# EAGLE design Power (EAGLE 8.5.2)
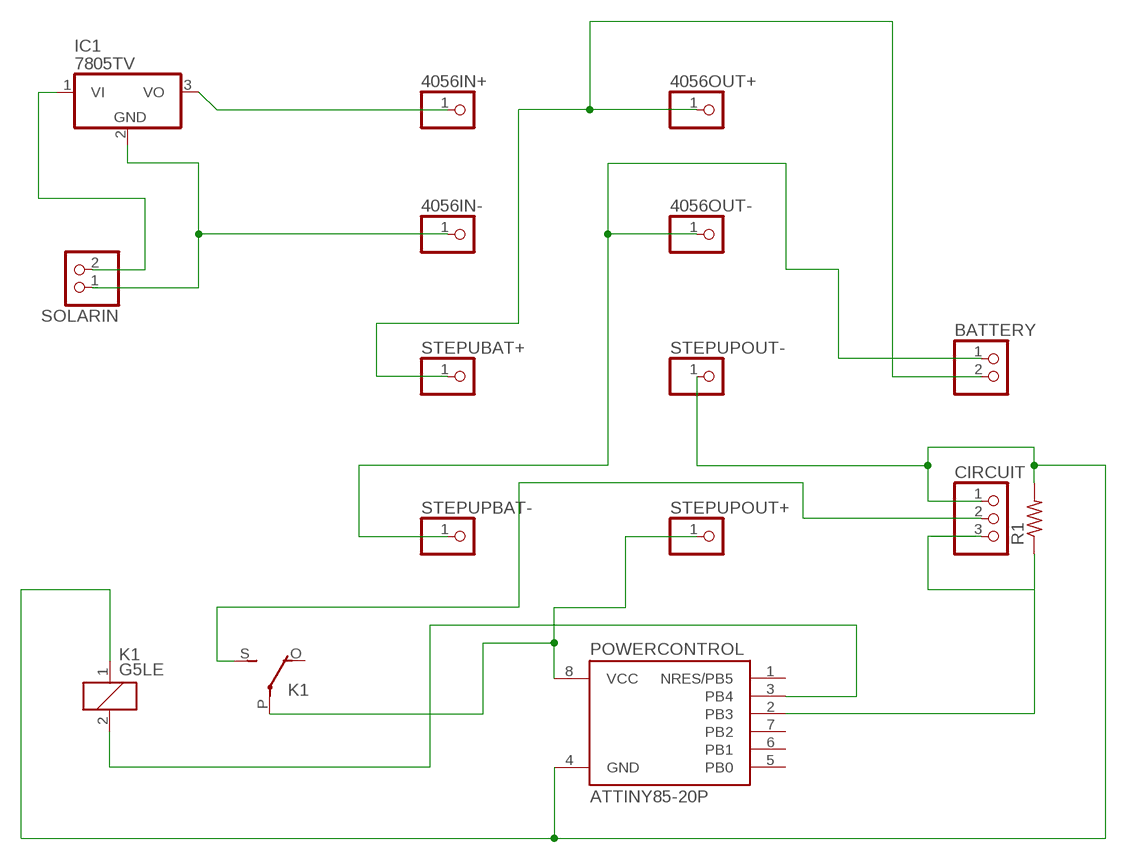
[diagram p0: schematic, sheet 1]

## Parts
4056IN+  PINHD-1X1  [1X01]
4056IN-  PINHD-1X1  [1X01]
4056OUT+  PINHD-1X1  [1X01]
4056OUT-  PINHD-1X1  [1X01]
BATTERY  PINHD-1X2  [1X02]
CIRCUIT  PINHD-1X3  [1X03]
IC1  7805TV  [TO220V]
K1  G5LE  [G5LE]
POWERCONTROL  ATTINY85-20P  [PDIP08_300MIL]
R1  R-US_0204/7  [0204/7]
SOLARIN  PINHD-1X2  [1X02]
STEPUBAT+  PINHD-1X1  [1X01]
STEPUPBAT-  PINHD-1X1  [1X01]
STEPUPOUT+  PINHD-1X1  [1X01]
STEPUPOUT-  PINHD-1X1  [1X01]

## Nets
N$1: IC1.1(VI) SOLARIN.2
N$2: 4056IN-.1 IC1.2(GND) SOLARIN.1
N$3: 4056IN+.1 IC1.3(VO)
N$4: 4056OUT+.1 BATTERY.2 STEPUBAT+.1
N$5: K1.2 POWERCONTROL.3(PB4)
N$6: K1.P(2:P) POWERCONTROL.8(VCC) STEPUPOUT+.1
N$7: CIRCUIT.2 K1.S(2:S)
N$8: CIRCUIT.1 K1.1 POWERCONTROL.4(GND) R1.2 STEPUPOUT-.1
N$11: CIRCUIT.3 POWERCONTROL.2(PB3) R1.1
N$12: 4056OUT-.1 BATTERY.1 STEPUPBAT-.1
Unconnected: K1.O(2:O) POWERCONTROL.1(NRES/PB5) POWERCONTROL.5(PB0) POWERCONTROL.6(PB1) POWERCONTROL.7(PB2)

## Library data of the parts
4056IN+ 4056IN- 4056OUT+ 4056OUT- STEPUBAT+ STEPUPBAT- STEPUPOUT+ STEPUPOUT- = pinhead:PINHD-1X1: PIN HEADER
BATTERY SOLARIN = pinhead:PINHD-1X2: PIN HEADER
CIRCUIT = pinhead:PINHD-1X3: PIN HEADER
IC1 = linear:78*: Positive VOLTAGE REGULATOR Source: http://cache.national.com/ds/LM/LM78L05.pdf http://www.fairchildsemi.com/ds/LM/LM7805.pdf
K1 = relay:G5LE: RELAY 1 x switch, 10 A/120 V AC, 8 A/30 V DC, Omron; OC_FARNELL: unknown; OC_NEWARK: unknown
POWERCONTROL = _hhn_attiny25_45_85:ATTINY85*: ATMEL ATtiny 85 Packages: P = PDIP 08 30mil S = SOIC 08 EIAJ 208mil Technologies Note: for complete ordering code (temp. range, finish, tape&reel etc.) see www.atmel.com • Supply Voltage: V = (1.8…5.5)V | [blank] = (2.7…5.5)V • Speed: 10 = 10 MHz | 20 = 20 MHz Author: Dipl.-Ing. FH Rainer Bayer HHN Hochschule Heilbronn (Heilbronn University), rainer.bayer@hs-heilbronn.de Ingenieurbüro ing-rb, mail@ing-rb.de
R1 = resistor:R-US_: RESISTOR, American symbol

## Board
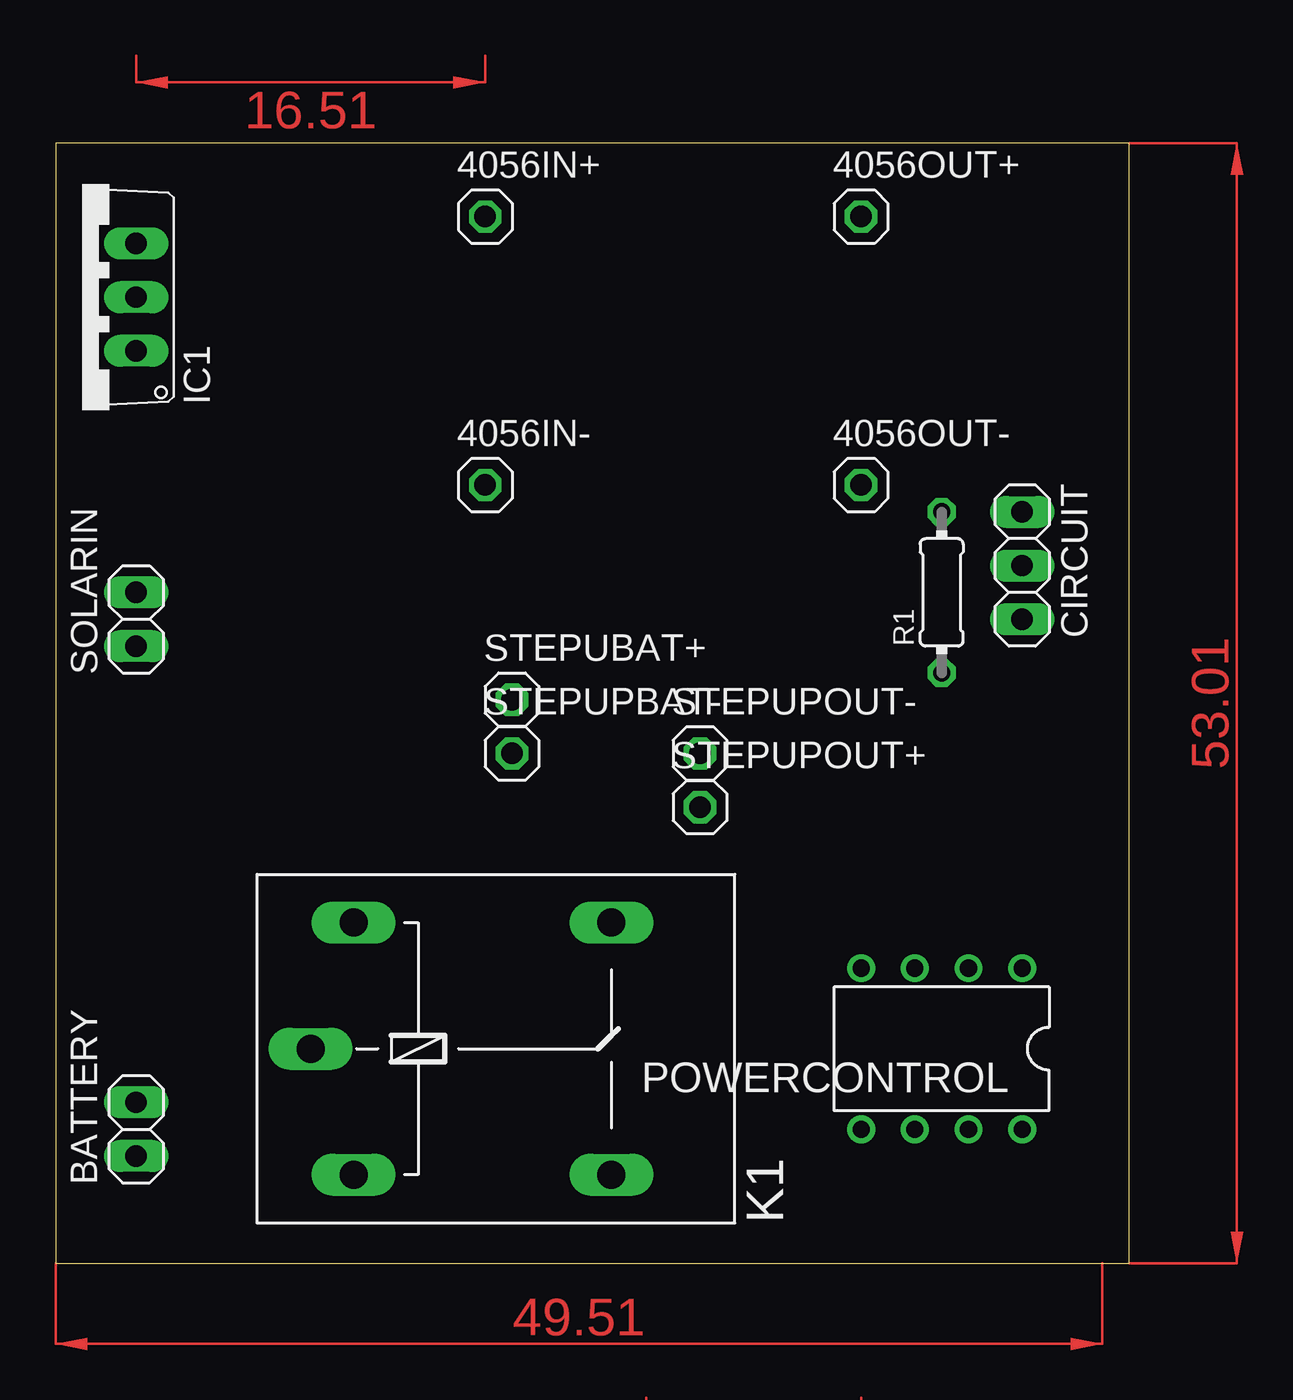
[diagram p1: board, top side]
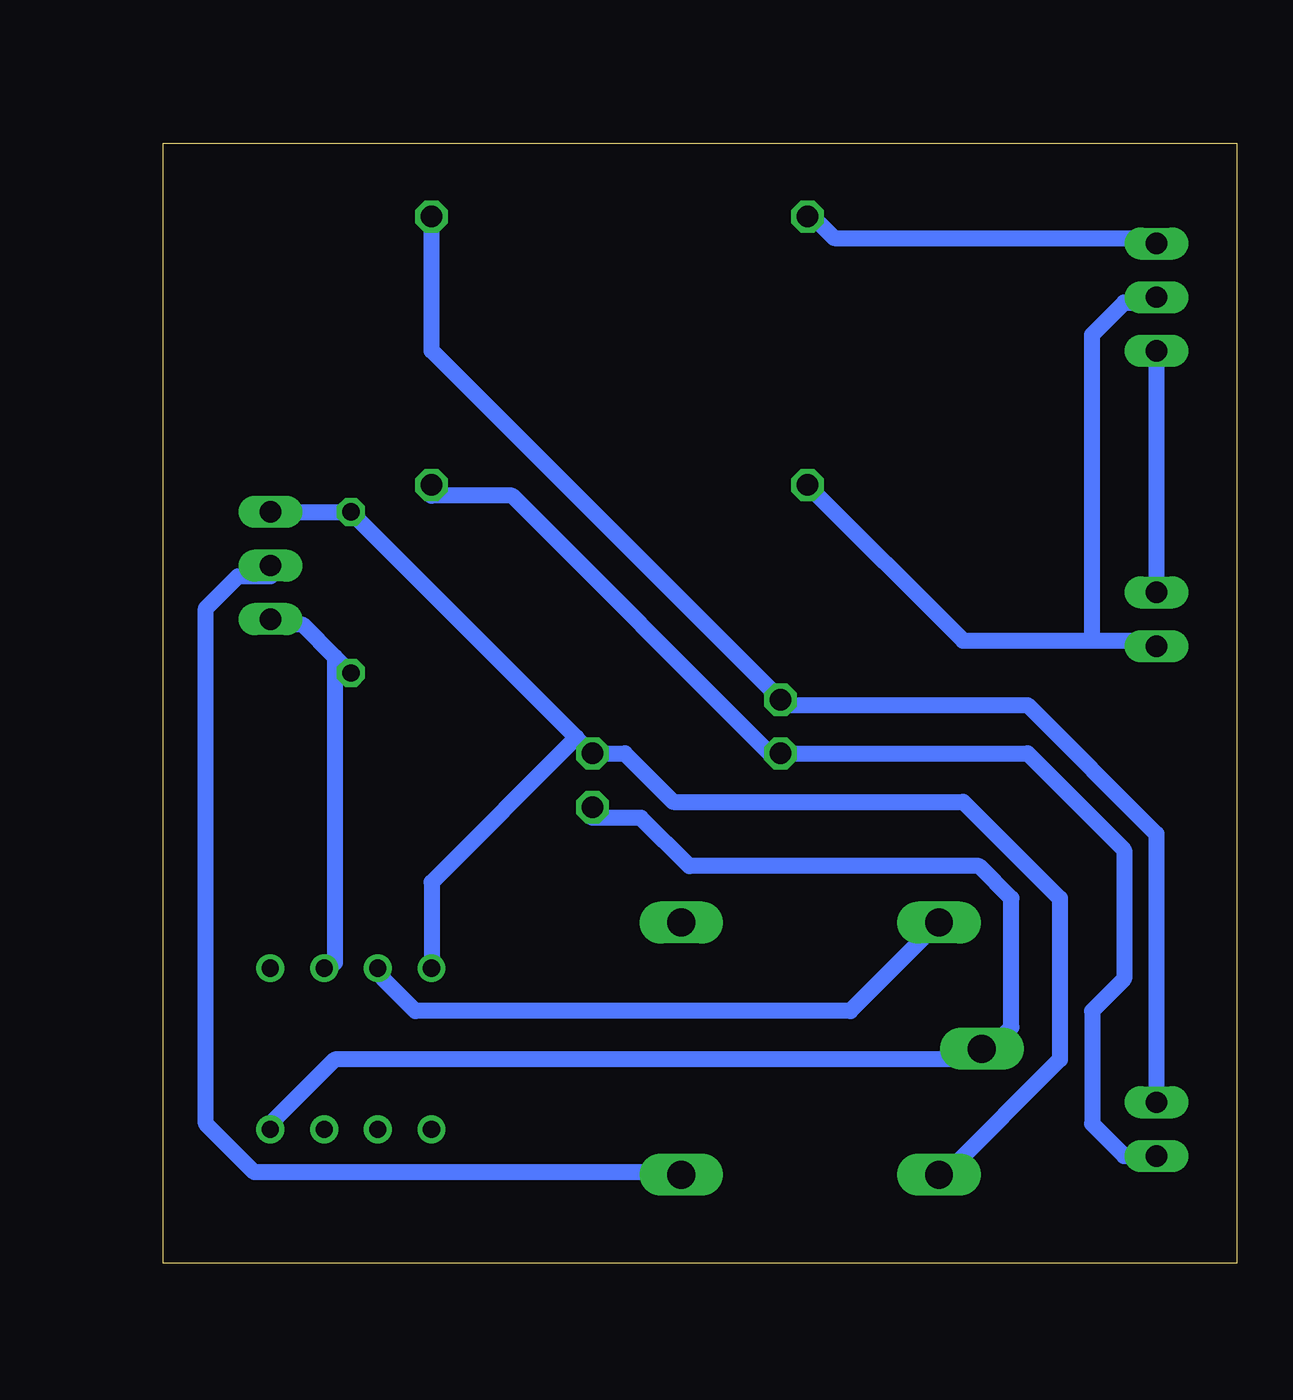
[diagram p2: board, bottom side, seen from below]

Size 50.78 x 53.01 mm. Coordinates in mm from the lower left corner, seen from the top.
Outline: 0,0 50.78,0 50.78,53.01 0,53.01 0,0
Copper layers (1*16): Top 0.035mm / dielectric 1.5mm / Bottom 0.035mm
Design rules "default *": minimum track width 30mil, minimum drill 0.35mm, track to track 30mil, track to pad 30mil, pad to pad 30mil, via to via 30mil, smd to smd 6mil, copper to edge 40mil, drill to drill 6mil, minimum pad ring 10mil, minimum via ring 8mil, stop-mask expansion 4mil, vias tented up to drill 0mil, thermal gap 10mil

### Footprints (pad centres in the part's own frame; a part is rotated, then mirrored left to right if it is on the bottom)
1X01 = drill 1.016 octagon: 1 0,0
1X02 = drill 1.016 long: 1 -1.27,0; 2 1.27,0
1X03 = drill 1.016 long: 1 -2.54,0; 2 0,0; 3 2.54,0
TO220V = drill 1.016 long: 1 -2.54,-2.54; 2 0,-2.54; 3 2.54,-2.54
G5LE = drill 1.321 long: 1 -7.493,-5.969; 2 -7.493,5.969; O 4.699,5.969; P -9.525,0; S 4.699,-5.969
PDIP08_300MIL = drill 0.813: 1 -3.81,-3.81; 2 -1.27,-3.81; 3 1.27,-3.81; 4 3.81,-3.81; 5 3.81,3.81; 6 1.27,3.81; 7 -1.27,3.81; 8 -3.81,3.81
0204/7 = drill 0.813 octagon: 1 -3.81,0; 2 3.81,0

### Placement (x,y rotation side)
4056IN+  20.32,49.53 0 top
4056IN-  20.32,36.83 0 top
4056OUT+  38.1,49.53 0 top
4056OUT-  38.1,36.83 0 top
BATTERY  3.81,6.35 90 top
CIRCUIT  45.72,33.02 270 top
IC1  1.27,45.72 90 top
K1  21.59,10.16 0 top
POWERCONTROL  41.91,10.16 180 top
R1  41.91,31.75 90 top
SOLARIN  3.81,30.48 90 top
STEPUBAT+  21.59,26.67 0 top
STEPUPBAT-  21.59,24.13 0 top
STEPUPOUT+  30.48,21.59 0 top
STEPUPOUT-  30.48,24.13 0 top

### Tracks (layer width: path | path; a pad name or v marks a point on that pad's centre or on a via)
N$1
  Bottom 0.762: IC1.1 SOLARIN.2
N$2
  Bottom 0.762: 6.86,29.46 12.95,29.46 4056IN-.1 | 6.86,29.46 3.81,29.46 SOLARIN.1 | 6.86,29.46 6.86,43.94 5.33,45.47 3.81,45.47 IC1.2
N$3
  Bottom 0.762: IC1.3 3.81,48.51 19.05,48.51 19.81,49.28 4056IN+.1
N$4
  Bottom 0.762: BATTERY.2 3.81,20.32 9.91,26.42 21.34,26.42 STEPUBAT+.1 38.1,43.18 4056OUT+.1
N$5
  Bottom 0.762: K1.2 18.29,11.94 38.86,11.94 40.39,13.46 POWERCONTROL.3
N$6
  Bottom 0.762: POWERCONTROL.8 45.72,6.6 42.67,9.65 12.19,9.65 K1.P 11.43,10.41 10.67,11.18 10.67,17.27 12.19,18.8 25.91,18.8 28.19,21.08 30.48,21.08 STEPUPOUT+.1
N$7
  Bottom 0.762: CIRCUIT.2 45.72,32.51 47.24,32.51 48.77,30.99 48.77,6.6 46.48,4.32 26.67,4.32 K1.S
N$8
  Bottom 0.762: CIRCUIT.1 R1.2 31.24,24.89 | 31.24,24.89 STEPUPOUT-.1 28.96,24.13 26.67,21.84 12.95,21.84 8.38,17.27 8.38,9.65 13.72,4.32 K1.1 | POWERCONTROL.4 38.1,18.03 31.24,24.89
N$11
  Bottom 0.762: R1.1 42.67,28.7 | 42.67,28.7 44.2,30.23 45.72,30.23 CIRCUIT.3 | 42.67,28.7 42.67,14.22 POWERCONTROL.2
N$12
  Bottom 0.762: BATTERY.1 5.33,5.08 6.86,6.6 6.86,11.94 5.33,13.46 5.33,19.56 9.91,24.13 STEPUPBAT-.1 22.1,24.13 34.29,36.32 38.1,36.32 4056OUT-.1
(copper drawn outside any net)
  shapes: Top area x5